# Altium project shift board.PrjPcb
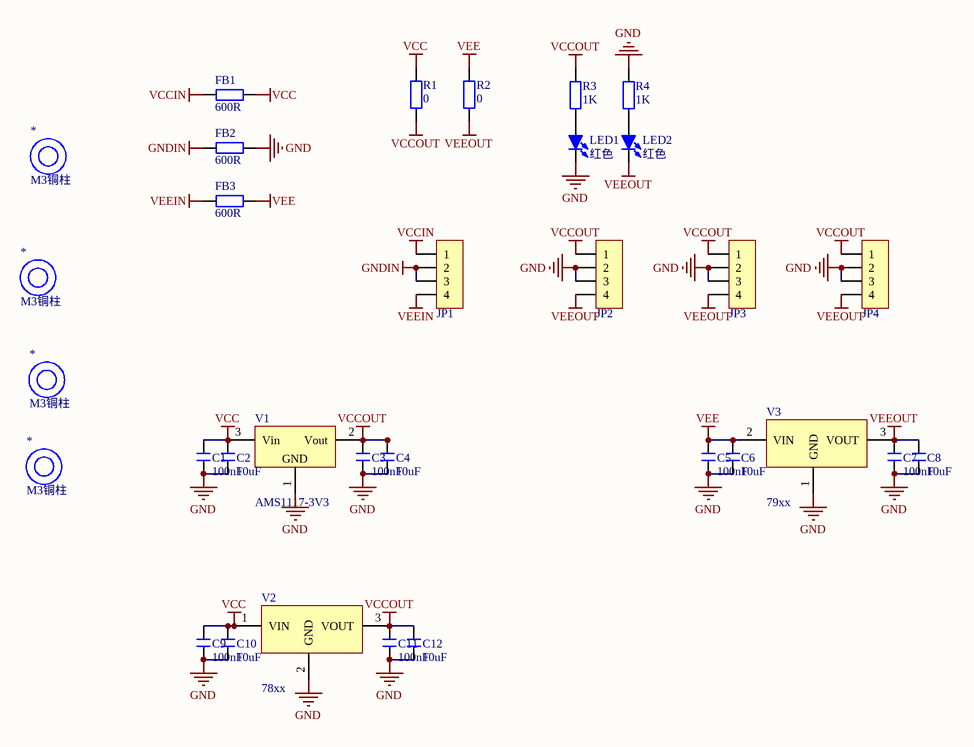
[diagram p0: shift board.SchDoc]
1 sheet, 32 parts. Net scope: global (net labels, ports and power ports of the same name join across sheets).
Board file: shift board.PcbDoc

## Sheet shift board.SchDoc
size A4

### Parts
(Parts that share a designator on the sheet are numbered #1, #2 ... from top to bottom, then left to right.)
*#1  M3铜柱  [M3x10+6_L]
*#2  M3铜柱  [M3x10+6_L]
*#3  M3铜柱  [M3x10+6_L]
*#4  M3铜柱  [M3x10+6_L]
C1  100nF  [C 0603_L]
C2  10uF  [C 0603_L]
C3  100nF  [C 0603_L]
C4  10uF  [C 0603_L]
C5  100nF  [C 0603_L]
C6  10uF  [C 0603_L]
C7  100nF  [C 0603_L]
C8  10uF  [C 0603_L]
C9  100nF  [C 0603_L]
C10  10uF  [C 0603_L]
C11  100nF  [C 0603_L]
C12  10uF  [C 0603_L]
FB1  600R  [FB-0805]
FB2  600R  [FB-0805]
FB3  600R  [FB-0805]
JP1  HDR-1X4  [VH3.96-LI-4P]  (value not drawn)
JP2  HDR-1X4  [VH3.96-LI-4P]  (value not drawn)
JP3  HDR-1X4  [VH3.96-LI-4P]  (value not drawn)
JP4  HDR-1X4  [VH3.96-LI-4P]  (value not drawn)
LED1  红色  [LED 0805G]
LED2  红色  [LED 0805G]
R1  0  [R 0603_L]
R2  0  [R 0603_L]
R3  1K  [R 0603_L]
R4  1K  [R 0603_L]
V1  AMS1117-3V3  [SOT223_L]
V2  78xx  [TO252]
V3  79xx  [TO252]

### Nets
GND: C1.1 C2.1 C3.1 C4.1 C5.1 C6.1 C7.1 C8.1 C9.1 C10.1 C11.1 C12.1 FB2.2 JP2.2 JP2.3 JP3.2 JP3.3 JP4.2 JP4.3 LED1.2(K) R4.2 V1.1(GND) V2.2(GND) V3.1(GND)
GNDIN: FB2.1 JP1.2 JP1.3
VCC: C1.2 C2.2 C9.2 C10.2 FB1.2 R1.2 V1.3(Vin) V2.1(VIN)
VCCIN: FB1.1 JP1.1
VCCOUT: C3.2 C4.2 C11.2 C12.2 JP2.1 JP3.1 JP4.1 R1.1 R3.2 V1.2(Vout) V2.3(VOUT)
VEE: C5.2 C6.2 FB3.2 R2.2 V3.2(VIN)
VEEIN: FB3.1 JP1.4
VEEOUT: C7.2 C8.2 JP2.4 JP3.4 JP4.4 LED2.2(K) R2.1 V3.3(VOUT)
NetLED1_1: LED1.1(A) R3.1
NetLED2_1: LED2.1(A) R4.1

### Library data of the parts
C1-C12 = C: 无极性贴片电容; 版权归属: 源创客; BOM名称: 无极性贴片电容; 学习资源: www.ooocke.com
FB1-FB3 = FB
JP1-JP4 = Header 4_1: 4P接插件; 版权归属: 源创客; BOM名称: 4P接插件; 学习资源: www.ooocke.com
LED1 LED2 = LED-SMD: 贴片LED; 版权归属: 源创客; BOM名称: 贴片LED; 学习资源: www.ooocke.com
R1-R4 = R: 贴片电阻; 版权归属: 源创客; BOM名称: 贴片电阻; 学习资源: www.ooocke.com
V1 = AMS1117: 三端稳压芯片; BOM名称: 稳压芯片; 版权归属: 源创客; 学习资源: www.ooocke.com
V2 = 78xx: 线性稳压芯片; 版权归属: 源创客; BOM名称: 线性稳压芯片; 学习资源: www.ooocke.com
V3 = 79xx: 线性稳压芯片; 版权归属: 源创客; BOM名称: 线性稳压芯片; 学习资源: www.ooocke.com